# EAGLE design WGPS Featherwing (EAGLE 8.2.2)
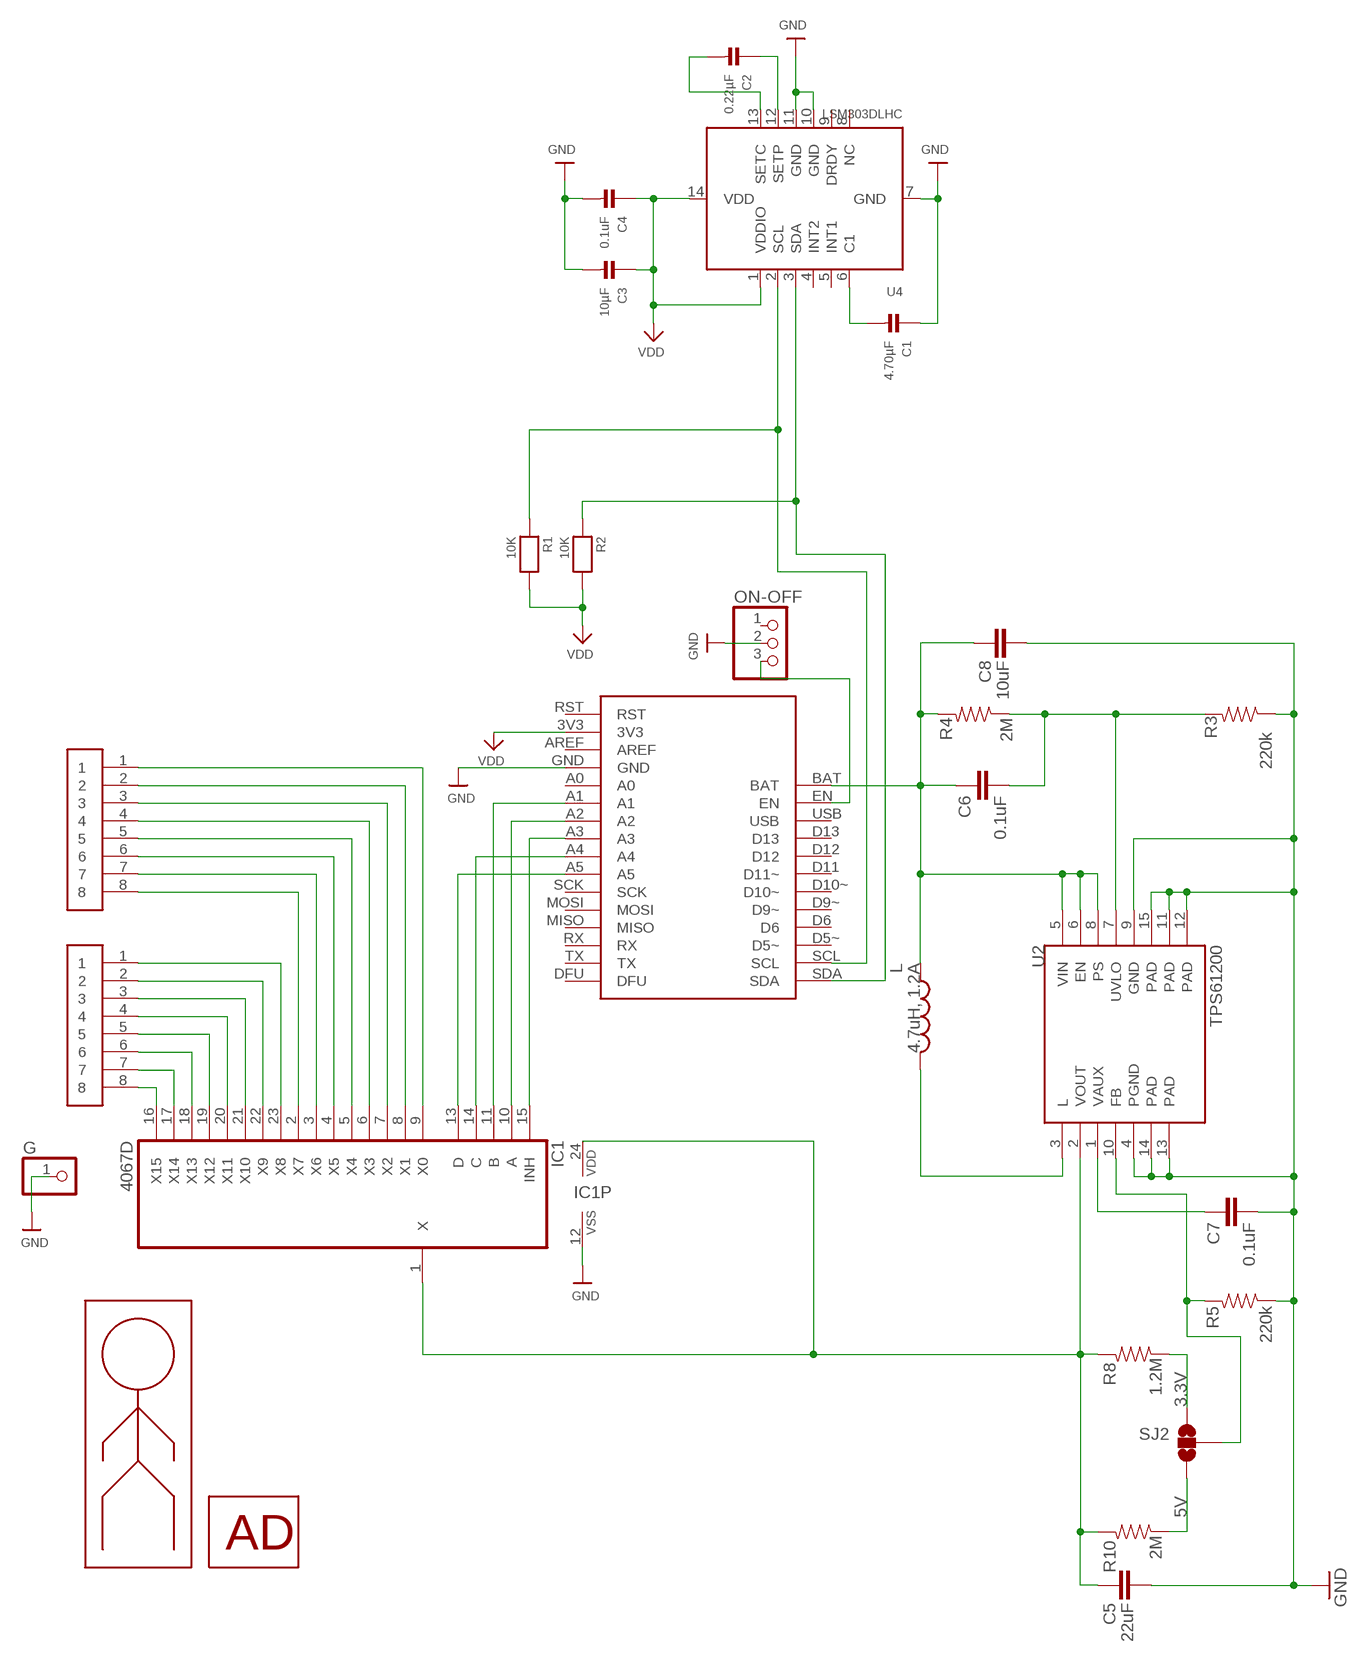
[diagram p0: schematic, sheet 1]

## Parts
C1  4.70µF  CAP_CERAMIC_0805  [_0805]
C2  0.22µF  CAP_CERAMIC_0805  [_0805]
C3  10µF  CAP_CERAMIC_0805  [_0805]
C4  0.1uF  CAP_CERAMIC_0805  [_0805]
C5  22uF  CAP0805  [0805]
C6  0.1uF  CAP0603-CAP  [0603-CAP]
C7  0.1uF  CAP0603-CAP  [0603-CAP]
C8  10uF  CAP1206  [1206]
G  PINHD-1X1CB  [1X01-CLEANBIG]
IC1  4067D  [SO24W]
L  4.7uH, 1.2A  INDUCTOR.  [CDRH2D09]
ON-OFF  UXCELL_SWITCHCB  [1X03-CLEANBIG]
R1  10K  RESISTOR_0805  [_0805]
R2  10K  RESISTOR_0805  [_0805]
R3  220k  RESISTOR0603-RES  [0603-RES]
R4  2M  RESISTOR0603-RES  [0603-RES]
R5  220k  RESISTOR0603-RES  [0603-RES]
R8  1.2M  RESISTOR0603-RES  [0603-RES]
R10  2M  RESISTOR0603-RES  [0603-RES]
SJ2  SOLDERJUMPER_2WAYPASTE2&3  [SJ_3_PASTE2&3]
U2  TPS61200  [QFN-10_PAD]
U4  LSM303DLHC  [LGA14]
U$1  SMD_FEATHERWING_BLE_32U4  [FEATHERWING_MALE_SMD_HEADERS_0.1]
U$3  AD_LOGO  [AD_LOGO_0.25IN]
U$6  SMD_JST_1X8  [SMD_JST_1X8]
U$7  SMD_JST_1X8  [SMD_JST_1X8]
U$16  MAN_LOGO  [MAN_LOGO_0.6]

## Nets
3.3V: R8.1 SJ2.1
5V: R10.1 SJ2.3
5V+: C5.1 IC1.1(X) IC1.24(VDD) R8.2 R10.2 U2.2(VOUT)
BAT: C6.1 C8.1 L.P$2 R4.2 U2.5(VIN) U2.6(EN) U2.8(PS) U$1.BAT
C1: C1.2 U4.6(C1)
C2.A: C2.1 U4.12(SETP)
C2.B: C2.2 U4.13(SETC)
FB1: R5.2 SJ2.2 U2.10(FB)
GND: C1.1 C3.2 C4.2 C5.2 C7.2 C8.2 G.1 IC1.12(VSS) ON-OFF.2 R3.1 R5.1 U2.4(PGND) U2.9(GND) U2.11(PAD) U2.12(PAD) U2.13(PAD) U2.14(PAD) U2.15(PAD) U4.7(GND) U4.10(GND) U4.11(GND) U$1.GND
L: L.P$1 U2.3(L)
MUX.0: IC1.9(X0) U$6.1
MUX.1: IC1.8(X1) U$6.2
MUX.2: IC1.7(X2) U$6.3
MUX.3: IC1.6(X3) U$6.4
MUX.4: IC1.5(X4) U$6.5
MUX.5: IC1.4(X5) U$6.6
MUX.6: IC1.3(X6) U$6.7
MUX.7: IC1.2(X7) U$6.8
MUX.8: IC1.23(X8) U$7.1
MUX.9: IC1.22(X9) U$7.2
MUX.10: IC1.21(X10) U$7.3
MUX.11: IC1.20(X11) U$7.4
MUX.12: IC1.19(X12) U$7.5
MUX.13: IC1.18(X13) U$7.6
MUX.14: IC1.17(X14) U$7.7
MUX.15: IC1.16(X15) U$7.8
MUX.A: IC1.10(A) U$1.A2
MUX.B: IC1.11(B) U$1.A1
MUX.C: IC1.14(C) U$1.A4
MUX.D: IC1.13(D) U$1.A5
MUX.INH: IC1.15(INH) U$1.A3
N$1: ON-OFF.3 U$1.EN
N$25: C7.1 U2.1(VAUX)
SCL: R1.1 U4.2(SCL) U$1.SCL
SDA: R2.1 U4.3(SDA) U$1.SDA
UVLO1: C6.2 R3.2 R4.1 U2.7(UVLO)
VDD: C3.1 C4.1 R1.2 R2.2 U4.1(VDDIO) U4.14(VDD) U$1.3V3
Unconnected: ON-OFF.1 U4.4(INT2) U4.5(INT1) U4.8(NC) U4.9(DRDY) U$1.A0 U$1.AREF U$1.D5~ U$1.D6 U$1.D9~ U$1.D10~ U$1.D11(D11~) U$1.D12 U$1.D13 U$1.DFU U$1.MISO U$1.MOSI U$1.RST U$1.RX U$1.SCK U$1.TX U$1.USB

## Library data of the parts
C1-C4 = microbuilder:CAP_CERAMIC: Ceramic Capacitors 0402 - 0402 Surface Mount Capacitors 16pF 50V 5% [Digikey: 445-4899-2-ND] 18pF 50V 5% [Digikey: 490-1281-2-ND] 22pF 50V 5% [Digikey: 490-1283-2-ND] 68pF 50V 5% [Digikey: 490-1289-2-ND] 0.1uF 10V 10% [Digikey: 490-1318-2-ND] 1.0uF 6.3V 10% [Digikey: 490-1320-2-ND] 0603 - 0603 Surface Mount Capacitors 16 pF 50V 5% [Digikey: 445-5051-2-ND] 22 pF 50V [Digikey: PCC220ACVTR-ND] 33 pF 50V 5% [Digikey: 490-1415-1-ND] 56pF 50V 5% [Digikey: 490-1421-1-ND] 220pF 50V 5% [Digikey: 445-1285-1-ND] 680 pF 50V 2200 pF 50V 5% C0G [Digikey: 445-1297-1-ND] 5600 pF 100V 5% X7R [Digikey: 478-3711-1-ND] 0.1 µF 25V 10% [Digikey: PCC2277TR-ND] 0.22 µF 16V 10% X7R [Digikey: 445-1318-1-ND] 1.0 µF 25V 10% [Digikey: 445-5146-2-ND] 0603 - RF Specific 3pF 250V +/-0.1pF RF [Digikey: 712-1347-1-ND] 18 pF 250V 5% [Digikey: 478-3505-1-ND or 712-1322-1-ND] 56 pF 250V 5% C0G RF [Digikey: 490-4867-1-ND] 68 pF 250V RF [Digikey: 490-4868-1-ND] 0805 - 0805 Surface Mount Capacitors 220 pF 250V 2% RF Ceramic Capacitor [Digikey: 712-1398-1-ND] 1000 pF 50V 2% NP0 Ceramic Capacitor [Digikey: 478-3760-1-ND] 0.1 µF 25V 10% Ceramic Capacitor [Digikey: PCC1828TR-ND] 1.0 µF 16V 10% Ceramic Capacitor[Digikey: 490-1691-2-ND] 10.0 µF 10V 10% Ceramic Capacitor[Digikey: 709-1228-1-ND] 10.0 uF 16V 10% Ceramic Capacitor [Digikey: 478-5165-2-ND] 47 uF 6.3V 20% Ceramic Capacitor [Digikey: 587-1779-1-ND or 399-5506-1-ND] 1206 - 1206 Surface Mount Capacitors 47uF 10V 20% Ceramic Capacitor [Digikey: 490-5528-1-ND or 399-5508-1-ND or 445-6010-1-ND] 100uF 6.3V -20%, +80% Y5V Ceramic Capacitor (Digikey: 490-4512-1-ND, Mouser: 81-GRM31CF50J107ZE1L)
C5 C8 = CH_passive:CAP: Capacitor Standard 0603 ceramic capacitor, and 0.1" leaded capacitor.
C6 C7 = SparkFun:CAP: Capacitor Standard 0603 ceramic capacitor, and 0.1" leaded capacitor.
G = adafruit:PINHD-1X1: Pin header 1x1 for 0.1" spacing With round pins
IC1 = 40xx:4067: 16-channel ANALOG MULTIPLEXER
L = SparkFun:INDUCTOR: Inductors Basic Inductor/Choke - 0603 and 1206. Footprints are not proven and vary greatly between part numbers.
ON-OFF = Wearable GPS Featherwing:UXCELL_SWITCH: PIN HEADER
R1 R2 = microbuilder:RESISTOR: Resistors 0402 - 0402 Surface Mount Package 22 Ohm 1% 1/16W [Digikey: 311-22.0LRTR-ND] 33 Ohm 5% 1/16W 1.0K 5% 1/16W 1.5K 5% 1/16W 2.0K 1% 1/16W 10.0K 1% 1/16W [Digikey: 311-10.0KLRTR-ND] 10.0K 5% 1/16W [Digikey: RMCF0402JT10K0TR-ND] 12.1K 1% 1/16W [Digikey: 311-22.0LRTR-ND] 100.0K 5% 1/16W 0603 - 0603 Surface Mount Package 0 Ohm 1/10 Watt 1% Resistor 15 Ohm 1/10 Watt 1% Resistor 33 Ohm 1/10 Watt 1% Resistor 49.9 Ohm 1/10 Watt 1% Resistor 100 Ohm 1/10 Watt 1% Resistor 150 Ohm 1/10 Watt 1% Resistor 240 Ohm 1/10 Watt 1% Resistor 390 Ohm 1/10 Watt 1% Resistor 560 Ohm 1/10 Watt 1% Resistor 680 Ohm 1/10 Watt 1% Resistor 750 Ohm 1/10 Watt 1% Resistor 1.0K Ohm 1/10 Watt 1% Resistor 1.5K Ohm 1/10 Watt 1% Resistor 2.0K Ohm 1/10 Watt 1% Resistor 2.2K Ohm 1/10 Watt 1% Resistor 3.3K Ohm 1/10 Watt 1% Resistor 4.7K Ohm 1/10 Watt 1% Resistor 10.0K Ohm 1/10 Watt 1% Resistor 12.0K Ohm 1/10 Watt 1% Resistor 12.1K Ohm 1/10 Watt 1% Resistor 20.0K Ohm 1/10 Watt 1% Resistor 33.0K Ohm 1/10 Watt 1% Resistor 100.0K Ohm 1/10 Watt 1% Resistor 0805 - 0805 Surface Mount Package 0 Ohm 1/8 Watt 1% Resistor 33 Ohm 1/8 Watt 1% Resistor 100 Ohm 1/8 Watt 1% Resistor 150 Ohm 1/8 Watt 1% Resistor 200 Ohm 1/8 Watt 1% Resistor 240 Ohm 1/8 Watt 1% Resistor 330 Ohm 1/8 Watt 1% Resistor 390 Ohm 1/8 Watt 1% Resistor 470 Ohm 1/8 Watt 1% Resistor 1.0K Ohm 1/8 Watt 1% Resistor 1.5K Ohm 1/8 Watt 1% Resistor 2.0K Ohm 1/8 Watt 1% Resistor 4.7K Ohm 1/8 Watt 1% Resistor 5.1K Ohm 1/8 Watt 1% Resistor 5.6K Ohm 1/8 Watt 1% Resistor 10.0K Ohm 1/8 Watt 1% Resistor 22.0K Ohm 1/8 Watt 1% Resistor 33.0K Ohm 1/8 Watt 1% Resistor 100K Ohm 1/8 Watt 1% Resistor 1206 - 1206 Surface Mount Package 2012 - 2010 Surface Mount Package 0.11 Ohm 1/2 Watt 1% Resistor - Digikey: RHM.11UCT-ND
R3-R5 R8 R10 = SparkFun:RESISTOR: Resistor Basic schematic elements and footprints for 0603, 1206, and PTH resistors.
SJ2 = SparkFun:SOLDERJUMPER_2WAY: Solder Jumper 2 way solder jumper
U2 = SparkFun:TPS61200: DC to DC Booster
U4 = microbuilder:LSM303DLHC: LSM303DLHC 3-Axis I2C Accelerometer and 3-Axis Magnetometer VDD: 2.2-3.6V VDDIO: 1.8-VDD Magnetic Range: +/-1.3 to +/-8.1 gauss Accel Range: +/-2/4/8/16 g Temp: -40 - 85°C
U$1 = Wearable GPS Featherwing:SMD_FEATHERWING_BLE_32U4
U$3 = Wearable GPS Featherwing:AD_LOGO
U$6 U$7 = Wearable GPS Featherwing:SMD_JST_1X8
U$16 = Wearable GPS Featherwing:MAN_LOGO

## Board
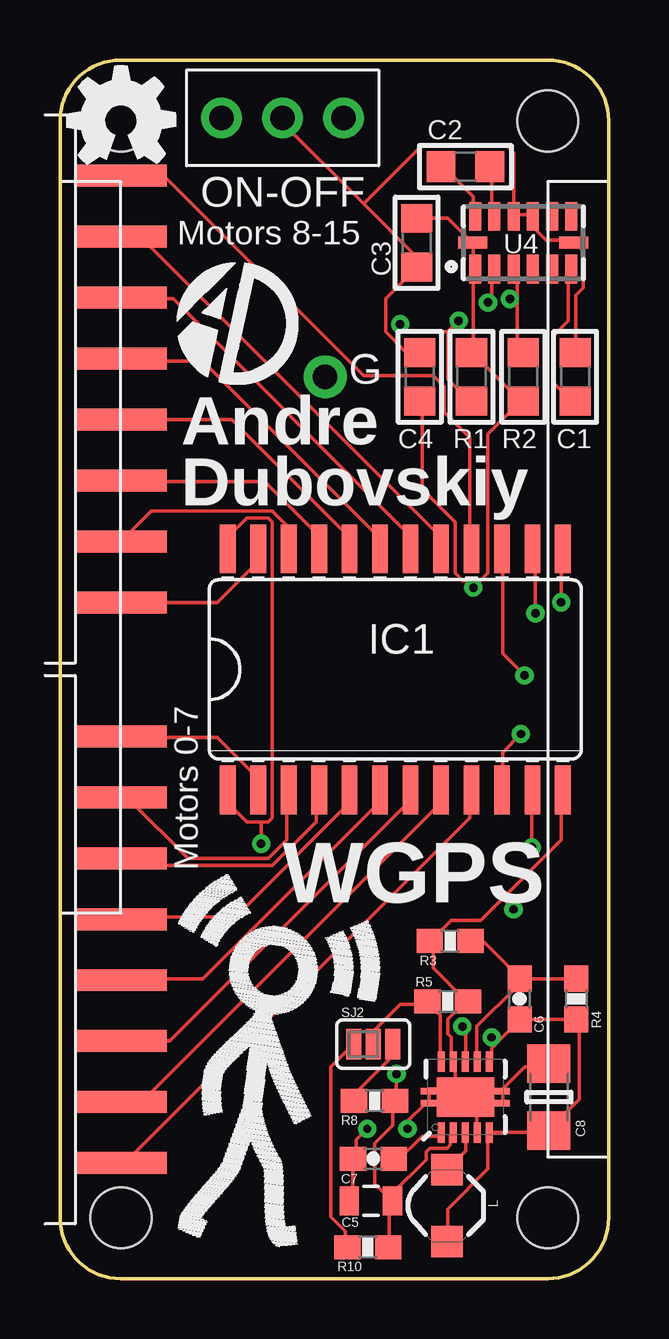
[diagram p1: board, top side]
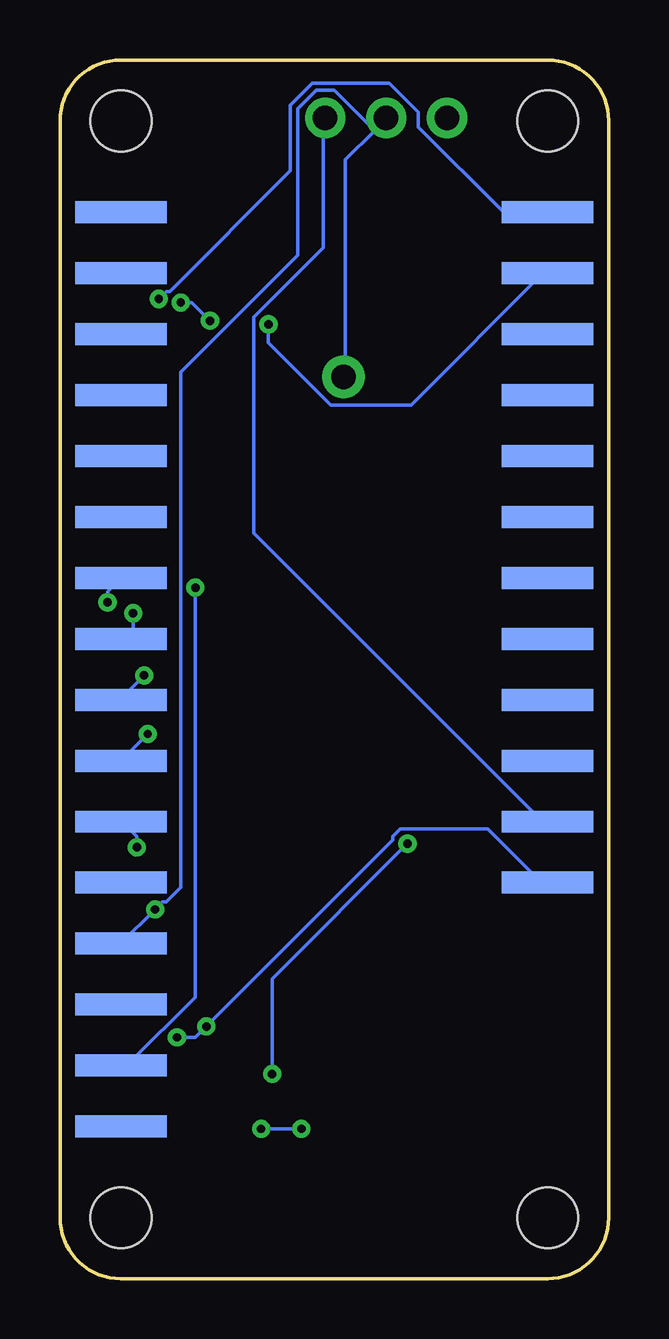
[diagram p2: board, bottom side, seen from below]

Size 22.86 x 50.8 mm. Coordinates in mm from the lower left corner, seen from the top.
Outline: 20.32,50.8 2.54,50.8 arc90 0,48.26 0,2.54 arc90 2.54,0 20.32,0 arc90 22.86,2.54 22.86,48.26 arc90 20.32,50.8
Copper layers (1*16): Top 0.035mm / dielectric 1.5mm / Bottom 0.035mm
Design rules "default *": minimum track width 6mil, minimum drill 0.35mm, track to track 6mil, track to pad 6mil, pad to pad 6mil, via to via 6mil, smd to smd 6mil, copper to edge 20mil, drill to drill 6mil, minimum pad ring 10mil, minimum via ring 8mil, stop-mask expansion 4mil, vias tented up to drill 0mil, thermal gap 10mil
Holes 2.54 mm at 20.32,48.26 20.32,2.54 2.54,48.26 2.54,2.54

### Footprints (pad centres in the part's own frame; a part is rotated, then mirrored left to right if it is on the bottom)
_0805 = smd 1.2 x 1.3: 1 -1.016,0; 2 1.016,0
0805 = smd 0.8 x 1.2: 1 -0.9,0; 2 0.9,0
0603-CAP = smd 1.1 x 1: 1 -0.85,0; 2 0.85,0
1206 = smd 1.6 x 1.8: 1 -1.4,0; 2 1.4,0
1X01-CLEANBIG = drill 1.016 pad 1.778: 1 0,0
SO24W = smd 0.66 x 2.032: 1 -6.985,-5.029; 2 -5.715,-5.029; 3 -4.445,-5.029; 4 -3.175,-5.029; 5 -1.905,-5.029; 6 -0.635,-5.029; 7 0.635,-5.029; 8 1.905,-5.029; 9 3.175,-5.029; 10 4.445,-5.029; 11 5.715,-5.029; 12 6.985,-5.029; 13 6.985,5.029; 14 5.715,5.029; 15 4.445,5.029; 16 3.175,5.029; 17 1.905,5.029; 18 0.635,5.029; 19 -0.635,5.029; 20 -1.905,5.029; 21 -3.175,5.029; 22 -4.445,5.029; 23 -5.715,5.029; 24 -6.985,5.029
CDRH2D09 = smd 1.3 x 1.3: P$1 -1.5,0; P$2 1.5,0
1X03-CLEANBIG = drill 1.016 pad 1.676: 1 -2.54,0; 2 0,0; 3 2.54,0
0603-RES = smd 1.1 x 1: 1 -0.85,0; 2 0.85,0
SJ_3_PASTE2&3 = smd 0.635 x 1.27: 1 -0.813,0; 2 0,0; 3 0.813,0
QFN-10_PAD = smd 0.297 x 0.85: 1 -1,-1.475; 2 -0.5,-1.475; 3 0,-1.475; 4 0.5,-1.475; 5 1,-1.475; 6 1,1.475; 7 0.5,1.475; 8 0,1.475; 9 -0.5,1.475; 10 -1,1.475 | smd 0.7 x 0.28: 11 -1.5,0.25; 12 -1.5,-0.25; 13 1.5,0.25; 14 1.5,-0.25 | smd 2.4 x 1.65: 15 0,0
LGA14 = smd 0.5 x 1.2: 1 2,1.1; 2 1.2,1.1; 3 0.4,1.1; 4 -0.4,1.1; 5 -1.2,1.1; 6 -2,1.1; 8 -2,-1.1; 9 -1.2,-1.1; 10 -0.4,-1.1; 11 0.4,-1.1; 12 1.2,-1.1; 13 2,-1.1 | smd 1.2 x 0.5: 7 -2.1,0; 14 2.1,0
FEATHERWING_MALE_SMD_HEADERS_0.1 = smd 3.81 x 0.914 bottom: 3V3 -19.05,35.56; A0 -19.05,27.94; A1 -19.05,25.4; A2 -19.05,22.86; A3 -19.05,20.32; A4 -19.05,17.78; A5 -19.05,15.24; AREF -19.05,33.02; BAT -1.27,27.94; D5~ -1.27,5.08; D6 -1.27,7.62; D9~ -1.27,10.16; D10~ -1.27,12.7; D11 -1.27,15.24; D12 -1.27,17.78; D13 -1.27,20.32; DFU -19.05,0; EN -1.27,25.4; GND -19.05,30.48; MISO -19.05,7.62; MOSI -19.05,10.16; RST -19.05,38.1; RX -19.05,5.08; SCK -19.05,12.7; SCL -1.27,2.54; SDA -1.27,0; TX -19.05,2.54; USB -1.27,22.86
SMD_JST_1X8 = smd 3.81 x 0.914: 1 0.635,1.27; 2 0.635,3.81; 3 0.635,6.35; 4 0.635,8.89; 5 0.635,11.43; 6 0.635,13.97; 7 0.635,16.51; 8 0.635,19.05

### Placement (x,y rotation side)
C1  21.46,37.59 270 top
C2  16.89,46.35 180 top
C3  14.86,43.18 270 top
C4  14.99,37.59 90 top
C5  12.95,3.25 180 top
C6  19.15,11.66 90 top
C7  13.06,5 180 top
C8  20.37,7.57 90 top
G  11.05,37.59 0 top
IC1  13.97,25.4 0 top
L  16.13,3.05 270 top
ON-OFF  9.27,48.39 0 top
R1  17.14,37.59 90 top
R2  19.3,37.59 270 top
R3  16.26,14.07 0 top
R4  21.51,11.66 270 top
R5  16.15,11.56 180 top
R8  13.11,7.42 0 top
R10  12.83,1.32 0 top
SJ2  13.06,9.78 180 top
U2  16.89,7.57 0 top
U4  19.3,43.18 180 top
U$1  1.27,44.45 180 top
U$3  4.87,37.26 0 top
U$6  1.91,3.56 0 top
U$7  1.91,26.92 0 top
U$15  [OSHW_5MM]  2.54,48.27 0 top
U$16  2.96,2.12 351.3 top

### Tracks (layer width: path | path; a pad name or v marks a point on that pad's centre or on a via)
3.3V
  Top 0.152: SJ2.1 13.87,9.3 12.34,7.77 12.34,7.47 R8.1
5V
  Top 0.152: R10.1 11.89,1.37 11.89,1.98 11.28,2.59 11.28,8.84 12.19,9.75 SJ2.3
5V+  (via drill 0.35)
  Top 0.152: R10.2 13.72,1.37 13.72,3.2 C5.1 | C5.1 13.72,3.35 13.11,3.96 13.11,5.64 13.87,6.4 13.87,7.32 R8.2 14.02,7.47 v14.02,8.53 | 8.38,19.05 8.69,19.05 8.84,19.2 8.84,31.55 8.69,31.7 7.77,31.7 7.01,30.94 7.01,30.48 IC1.24 | 8.38,19.05 7.77,19.05 7.01,19.81 7.01,20.27 IC1.1 | 8.38,19.05 v8.38,18.14 | C5.1 13.85,3.56 15.25,4.95 15.25,5.29 15.4,5.44 16.13,5.44 16.27,5.58 16.27,5.97 U2.2
  Bottom 0.152: v14.02,8.53 14.02,12.5 v8.38,18.14
BAT  (via drill 0.35)
  Top 0.152: 18.29,9.91 19.05,10.67 C6.1 19.2,10.82 21.49,10.82 R4.2 21.64,10.67 21.64,7.47 20.42,6.25 C8.1 20.27,6.1 17.98,6.1 U2.5 17.83,5.94 17.83,4.57 16.15,2.9 16.15,1.68 L.P$2 | 18.29,9.91 17.98,9.6 17.98,9.14 U2.6 | v16.76,10.52 16.92,10.36 16.92,9.14 U2.8 | 18.29,9.91 18.14,9.91 v17.98,10.06
  Bottom 0.152: U$1.BAT 2.59,16.61 2.9,16.61 5.03,18.75 8.69,18.75 8.99,18.44 8.99,18.29 v16.76,10.52 17.22,10.06 v17.98,10.06
C1
  Top 0.152: U4.6 21.18,42.06 21.18,39.93 20.57,39.32 20.57,37.34 21.34,36.58 C1.2
C2.A
  Top 0.152: U4.12 17.98,44.35 17.98,46.33 C2.1
C2.B
  Top 0.152: U4.13 17.22,44.35 17.22,45.11 16,46.33 C2.2
FB1
  Top 0.152: U2.10 15.85,9.14 15.85,10.97 15.39,11.43 R5.2 15.24,11.43 14.17,11.43 13.11,10.36 13.11,9.91 SJ2.2
GND  (via drill 0.35)
  Top 0.152: C5.2 12.19,3.35 12.19,4.88 C7.2 12.34,5.03 12.34,5.79 v12.8,6.25 | 16.46,7.92 16.46,8.99 U2.9 16.31,9.14 16.31,10.06 16.15,10.21 16.15,10.82 16.92,11.58 | 16.46,7.92 16.76,7.62 U2.15 | 17.37,7.01 17.37,6.1 U2.4 | 17.37,7.01 16.92,7.47 U2.15 | 16.46,7.92 15.39,7.92 U2.11 15.39,7.77 U2.12 15.24,7.32 14.48,6.55 v14.48,6.25 | 16.46,7.92 U2.15 | 17.37,7.01 17.68,7.32 18.29,7.32 U2.14 18.44,7.32 18.44,7.77 U2.13 18.44,7.92 19.36,8.84 20.27,8.84 C8.2 | 17.37,7.01 U2.15 | 16.92,11.58 15.54,12.95 15.54,14.02 R3.1 15.54,14.17 16.31,14.94 17.53,14.94 18.44,15.85 | 18.44,15.85 20.88,18.29 20.88,20.27 IC1.12 | 18.44,15.85 v18.9,15.39 | 16.92,11.58 R5.1 | C1.1 21.49,38.71 21.49,41 21.79,41.3 21.79,42.82 21.49,43.13 U4.7 21.34,43.28 20.27,43.28 19.81,43.74 19.81,44.2 U4.10 19.66,44.35 19.05,44.35 U4.11 18.9,44.35 18.9,46.94 18.59,47.24 15.09,47.24 12.65,44.81 | C4.2 14.94,38.71 14.33,38.71 13.56,39.47 13.56,40.84 14.78,42.06 C3.2 14.78,42.22 14.78,42.67 12.65,44.81 | 12.65,44.81 9.14,48.31 ON-OFF.2
  Bottom 0.152: v14.48,6.25 v12.8,6.25 | U$1.GND v18.9,15.39 18.59,15.7 18.44,15.7 17.83,16.31 17.83,37.8 12.95,42.67 12.95,48.77 12.19,49.53 11.43,49.53 9.75,47.85 | 9.75,47.85 9.3,48.31 ON-OFF.2 9.75,47.85 | 9.75,47.85 10.97,46.63 10.97,37.64 G.1
L
  Top 0.152: U2.3 16.92,5.94 16.92,5.33 16.15,4.57 L.P$1
MUX.0
  Top 0.152: IC1.9 17.07,20.27 17.07,19.2 2.59,4.72 U$6.1
MUX.1
  Top 0.152: IC1.8 15.85,20.27 15.85,19.81 3.5,7.47 2.59,7.47 U$6.2
MUX.2
  Top 0.152: U$6.3 4.57,9.91 14.48,19.81 14.48,20.27 IC1.7
MUX.3
  Top 0.152: IC1.6 13.26,20.27 13.26,19.81 5.94,12.5 2.59,12.5 U$6.4
MUX.4
  Top 0.152: IC1.5 12.04,20.27 12.04,19.81 7.32,15.09 2.59,15.09 U$6.5
MUX.5
  Top 0.152: IC1.4 10.67,20.27 10.67,19.05 8.84,17.22 2.9,17.22 2.59,17.53 U$6.6
MUX.6
  Top 0.152: IC1.3 9.45,20.27 9.45,18.29 8.69,17.53 5.33,17.53 2.9,19.96 2.59,19.96 U$6.7
MUX.7
  Top 0.152: IC1.2 8.23,20.42 8.23,20.88 6.55,22.55 2.59,22.55 U$6.8
MUX.8
  Top 0.152: U$7.1 6.55,28.19 8.23,29.87 8.23,30.33 IC1.23
MUX.9
  Top 0.152: U$7.2 3.81,32 8.84,32 9.45,31.39 9.45,30.48 IC1.22
MUX.10
  Top 0.152: IC1.21 10.67,30.48 10.67,31.09 8.53,33.22 2.59,33.22 U$7.3
MUX.11
  Top 0.152: U$7.4 7.16,35.81 12.04,30.94 12.04,30.48 IC1.20
MUX.12
  Top 0.152: IC1.19 13.26,30.48 13.26,30.94 5.94,38.25 2.59,38.25 U$7.5
MUX.13
  Top 0.152: IC1.18 14.48,30.48 14.48,31.09 4.72,40.84 2.59,40.84 U$7.6
MUX.14
  Top 0.152: U$7.7 3.35,43.43 15.85,30.94 15.85,30.48 IC1.17
MUX.15
  Top 0.152: IC1.16 17.07,30.48 17.07,35.05 16,36.12 16,37.19 15.54,37.64 12.65,37.64 4.42,45.87 2.59,45.87 U$7.8
MUX.A  (via drill 0.35)
  Top 0.152: v19.2,22.71 18.44,21.95 18.44,20.42 IC1.10
  Bottom 0.152: U$1.A2 v19.2,22.71
MUX.B  (via drill 0.35)
  Top 0.152: v19.66,17.98 19.66,20.27 IC1.11
  Bottom 0.152: v19.66,17.98 19.66,18.44 20.27,19.05 U$1.A1
MUX.C  (via drill 0.35)
  Top 0.152: v19.81,27.74 19.81,30.33 IC1.14
  Bottom 0.152: v19.81,27.74 19.81,27.13 20.27,26.67 U$1.A4
MUX.D  (via drill 0.35)
  Top 0.152: v20.88,28.19 20.88,30.33 IC1.13
  Bottom 0.152: v20.88,28.19 20.88,28.65 U$1.A5
MUX.INH  (via drill 0.35)
  Top 0.152: v19.36,25.15 18.44,26.06 18.44,30.33 IC1.15
  Bottom 0.152: v19.36,25.15 20.27,24.23 U$1.A3
N$1
  Bottom 0.152: U$1.EN 2.74,19.05 14.78,31.09 14.78,40.08 11.89,42.98 11.89,48.31 ON-OFF.3
N$25
  Top 0.152: U2.1 15.85,5.94 15.09,5.94 14.02,4.88 C7.1
SCL  (via drill 0.35)
  Top 0.152: v17.83,40.69 17.98,40.84 17.98,42.06 U4.2 | 16.15,39.47 v16.61,39.93 | 16.15,39.47 16.15,37.49 17.07,36.58 R1.1 | 16.15,39.47 14.48,39.47 v14.17,39.78
  Bottom 0.152: v17.83,40.69 17.37,40.69 v16.61,39.93 | v14.17,39.78 14.17,39.01 11.58,36.42 8.23,36.42 2.74,41.91 U$1.SCL
SDA  (via drill 0.35)
  Top 0.152: 19.05,40.84 19.05,38.86 R2.1 | 19.05,40.84 19.05,42.06 U4.3 | v18.75,40.84 19.05,40.84
  Bottom 0.152: v18.75,40.84 18.44,41.15 18.29,41.15 13.26,46.18 13.26,48.92 12.34,49.84 9.14,49.84 7.92,48.62 7.92,48.01 4.42,44.5 2.59,44.5 U$1.SDA
UVLO1
  Top 0.152: U2.7 17.37,9.14 17.37,10.52 19.05,12.19 19.05,12.5 C6.2 | R3.2 17.22,14.02 17.68,14.02 19.05,12.65 C6.2 | R4.1 21.49,12.5 19.2,12.5 C6.2
VDD  (via drill 0.35)
  Top 0.152: C3.1 16.15,44.2 17.07,43.28 U4.14 17.22,43.13 17.22,42.22 U4.1 17.22,42.06 17.22,38.71 R1.2 17.22,38.56 19.2,36.58 | 17.22,29.11 17.53,29.11 17.83,29.41 17.83,35.2 19.2,36.58 | 17.22,29.11 16.76,29.11 16.46,29.41 16.46,31.55 15.09,32.92 15.09,36.58 C4.1 | 19.2,36.58 R2.2 | 17.22,29.11 v17.22,28.8
  Bottom 0.152: v17.22,28.8 17.22,11.73 19.96,8.99 20.27,8.99 U$1.3V3

### Text on the board
tPlace: Andre / Dubovskiy | WGPS
tNames: Motors 8-15 | Motors 0-7